# Altium schematic sheet Input_Analog.SchDoc
size A4
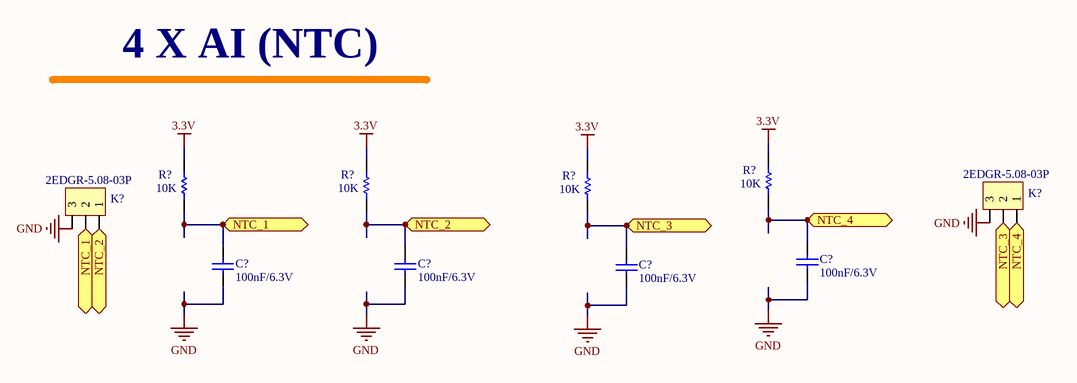
[diagram p0: Input_Analog.SchDoc]

## Parts
(Parts that share a designator on the sheet are numbered #1, #2 ... from top to bottom, then left to right.)
C?#1  100nF/6.3V  [CAP0603W]
C?#2  100nF/6.3V  [CAP0603W]
C?#3  100nF/6.3V  [CAP0603W]
C?#4  100nF/6.3V  [CAP0603W]
K?#1  2EDGR-5.08-03P  [CON_DG129_03P]
K?#2  2EDGR-5.08-03P  [CON_DG129_03P]
R?#1  10K  [RES1608[0603]]
R?#2  10K  [RES1608[0603]]
R?#3  10K  [RES1608[0603]]
R?#4  10K  [RES1608[0603]]

## Ports
NTC_1, NTC_2, NTC_3, NTC_4

## Nets
3.3V: R?#1.1 R?#2.1 R?#3.1 R?#4.1
GND: C?#1.2 C?#2.2 C?#3.2 C?#4.2 K?#1.3 K?#2.3
NTC_1: C?#1.1 K?#2.2 R?#1.2 ; port NTC_1
NTC_2: C?#2.1 K?#2.1 R?#2.2 ; port NTC_2
NTC_3: C?#4.1 K?#1.2 R?#4.2 ; port NTC_3
NTC_4: C?#3.1 K?#1.1 R?#3.2 ; port NTC_4

## Notes on the sheet
- 4 X AI (NTC)

## Library data of the parts
C?#1-C?#4 = CAP1: CAPACITOR 0603 Case; Value: 100nF; Published: 8-Jun-2000; LatestRevisionDate: 17-Jul-2002; LatestRevisionNote: Re-released for DXP Platform.; PackageReference: C1206; Publisher: Altium Limited
K?#1 K?#2 = KLEMENS_3P: CONNECTOR 5.08mm 3PIN 90DEG
R?#1-R?#4 = RES: RESISTOR 0603 Case %1; Value: 430R; Published: 8-Jun-2000; LatestRevisionDate: 17-Jul-2002; LatestRevisionNote: Re-released for DXP Platform.; PackageReference: AXIAL-0.5; Publisher: Altium Limited